# Altium schematic sheet Sheet1_02_21_dongho.SchDoc
size A; SheetNumber: 1; SheetTotal: 1
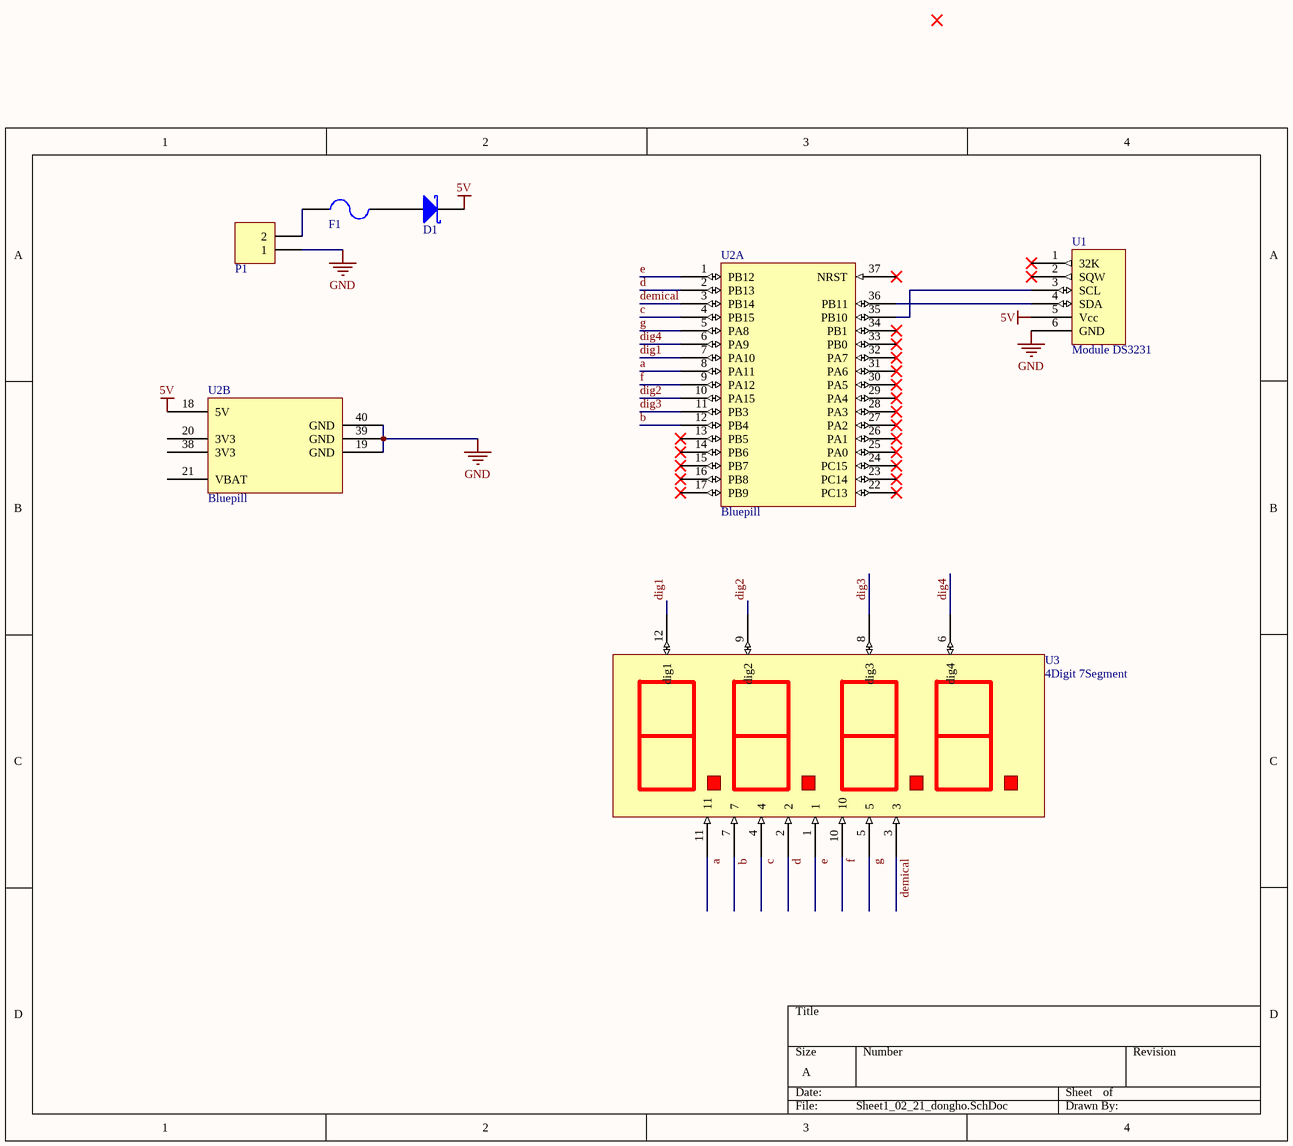
[diagram p0: Sheet1_02_21_dongho.SchDoc]

## Parts
D1  D Schottky  [SS34]  (value not drawn)
F1  Fuse  [FUSE SMD]  (value not drawn)
P1  Domino 2  [DOMINO 2- 5mm]  (value not drawn)
U1  Module DS3231  [Module DS3231( Part A )]
U2  Bluepill  [Blue Pill]  (parts A,B of 2)
U3  4Digit 7Segment  [4 digit 7 segment]

## Nets
5V: D1.2(K) U1.5(Vcc) U2.18(5V)
GND: P1.1 U1.6(GND) U2.19(GND) U2.39(GND) U2.40(GND)
a: U2.8(PA11) U3.11
b: U2.12(PB4) U3.7
c: U2.4(PB15) U3.4
d: U2.2(PB13) U3.2
demical: U2.3(PB14) U3.3
dig1: U2.7(PA10) U3.12(dig1)
dig2: U2.10(PA15) U3.9(dig2)
dig3: U2.11(PB3) U3.8(dig3)
dig4: U2.6(PA9) U3.6(dig4)
e: U2.1(PB12) U3.1
f: U2.9(PA12) U3.10
g: U2.5(PA8) U3.5
NetD1_1: D1.1(A) F1.2
NetF1_1: F1.1 P1.2
NetU1_3: U1.3(SCL) U2.35(PB10)
NetU1_4: U1.4(SDA) U2.36(PB11)

Not connected (* = marked no-connect by the designer): U1 1(32K)* 2(SQW)*; U2 13(PB5)* 14(PB6)* 15(PB7)* 16(PB8)* 17(PB9)* 20(3V3) 21(VBAT) 22(PC13)* 23(PC14)* 24(PC15)* 25(PA0)* 26(PA1)* 27(PA2)* 28(PA3)* 29(PA4)* 30(PA5)* 31(PA6)* 32(PA7)* 33(PB0)* 34(PB1)* 37(NRST)* 38(3V3)

## Library data of the parts
D1 = D Schottky: Schottky Diode; Published: 8-Jun-2000; LatestRevisionDate: 17-Jul-2002; LatestRevisionNote: Re-released for DXP Platform.; PackageReference: SMB; Publisher: Altium Limited; PackageDescription: DO-214-AA/SMB; 2 C-Bend Leads; Body 5.3 x 3.6 mm, inc. leads (LxW); Code_JEDEC: DO-214-AA
P1 = Domino 2: Domino, 2-Pin; LatestRevisionDate: 17-Jul-2002; LatestRevisionNote: Re-released for DXP Platform.; Publisher: Altium Limited
U1 = DS3231: The  DS3231  is  a  low-cost,  extremely  accurate  I2C  real-time clock (RTC) with an integrated temperature-compensated  crystal  oscillator  (TCXO)  and  crystal.; Operating Voltage: 3V3 - 5V5; Manufacturer: N/A; Module Dimensions: 38 x 22 x 14 (LxWxH); Interface Type: I2C; ComponentLink1Description: Order link; ComponentLink1URL: https://www.thegioiic.com/ds3231-mach-thoi-gian-thuc-co-ic-nho-at24c32; ComponentLink2Description: Datasheet; ComponentLink2URL: https://pdf1.alldatasheet.com/datasheet-pdf/view/254832/MAXIM/DS3231.html
U2 = STM32F103C8T6
U3 = 4Digit 7Segment: 4 digit 7 segment ( Anot chung)